# Altium schematic sheet TP4056.SchDoc: TP4056 Charging module
size A4; Revision: 1.0; SheetNumber: 2; SheetTotal: 2
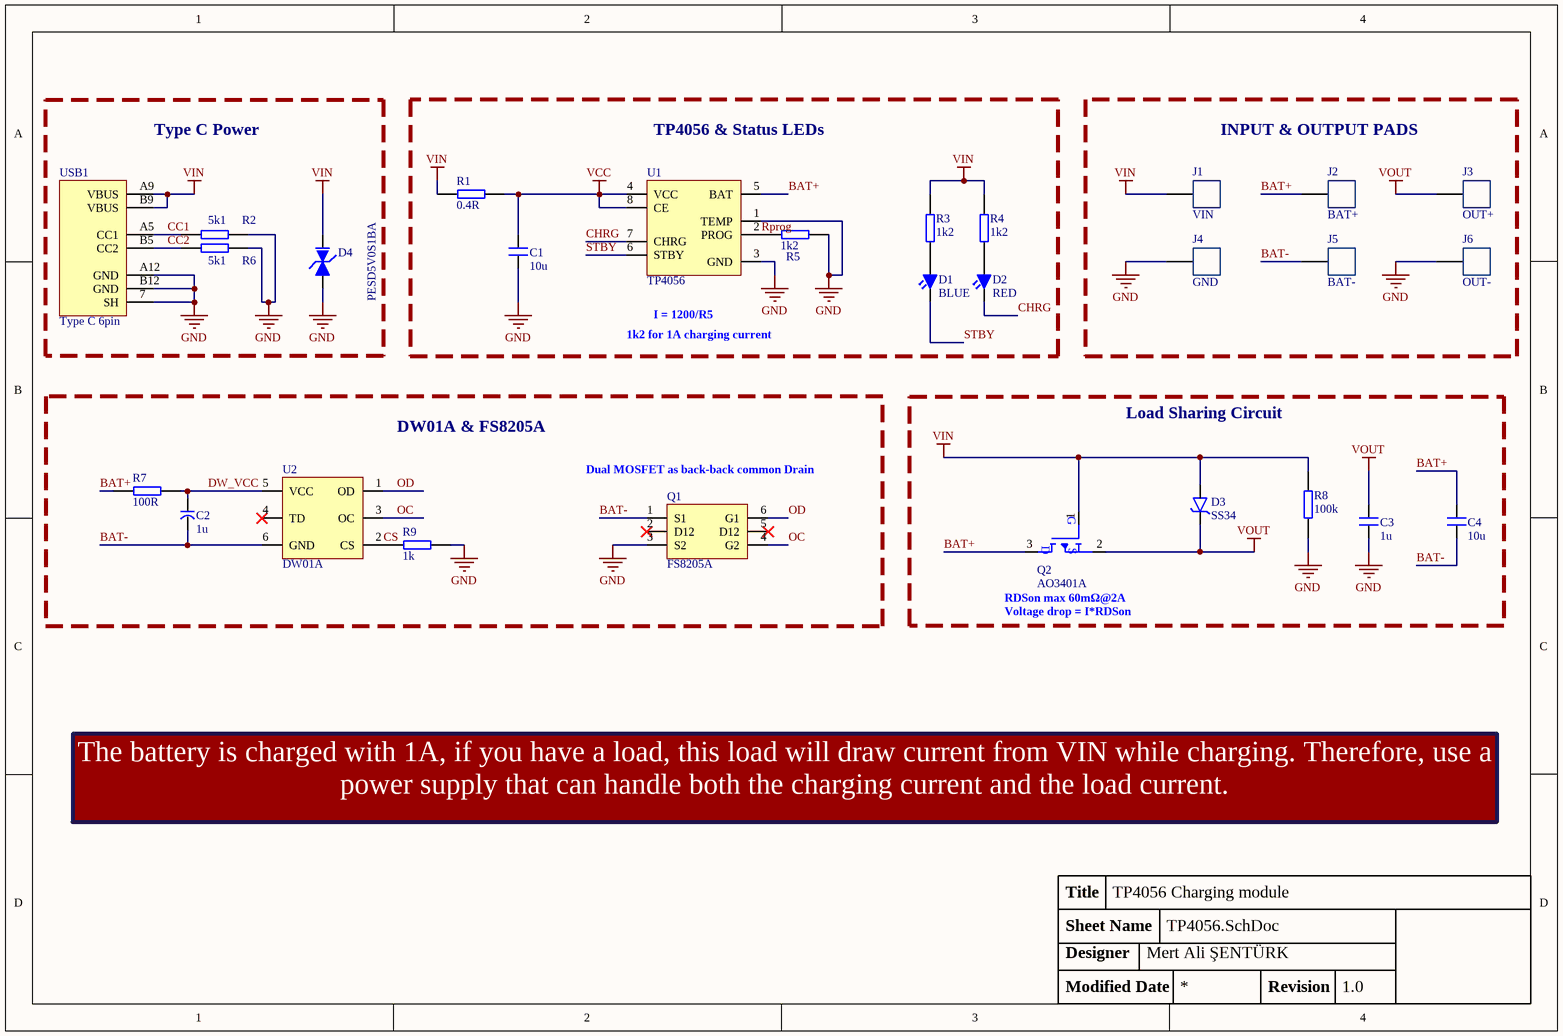
[diagram p0: TP4056.SchDoc]

## Parts
C1  10u  [0603 CAP]
C2  1u  [3216 cap]
C3  1u  [0805 CAP]
C4  10u  [0603 CAP]
D1  BLUE  [LED 0805]
D2  RED  [LED 0805]
D3  SS34  [SMA/DO-214AC]
D4  PESD5V0S1BA  [SOD-323]
J1  VIN  [PAD]  (no BOM)
J2  BAT+  [PAD]  (no BOM)
J3  OUT+  [PAD]  (no BOM)
J4  GND  [PAD]  (no BOM)
J5  BAT-  [PAD]  (no BOM)
J6  OUT-  [PAD]  (no BOM)
Q1  FS8205A  [SOT23-6]
Q2  AO3401A  [SOT23]
R1  0.4R  [2512 RES]
R2  5k1  [0603 RES]
R3  1k2  [0603 RES]
R4  1k2  [0603 RES]
R5  1k2  [0603 RES]
R6  5k1  [0603 RES]
R7  100R  [0603 RES]
R8  100k  [0603 RES]
R9  1k  [0603 RES]
U1  TP4056  [SOP-8]
U2  DW01A  [SOT23-6]
USB1  Type C 6pin  [TYPE-C 6P(073)]

## Blocks framed on the sheet
Type C Power: D4 R2 R6 USB1
TP4056 & Status LEDs: C1 D1 D2 R1 R3-R5 U1
INPUT & OUTPUT PADS: J1-J6
DW01A & FS8205A: C2 Q1 R7 R9 U2
Load Sharing Circuit: C3 C4 D3 Q2 R8

## Nets
GND: C1.1 C3.1 D4.2 J4.1 J6.1 Q1.3(S2) R2.2 R5.2 R6.2 R8.1 R9.2 U1.1(TEMP) U1.3(GND) USB1.7(SH) USB1.A12(GND) USB1.B12(GND)
VCC: C1.2 R1.1 U1.4(VCC) U1.8(CE)
VIN: D3.2 D4.1 J1.1 Q2.1 R1.2 R3.2 R4.2 R8.2 USB1.A9(VBUS) USB1.B9(VBUS)
VOUT: C3.2 D3.1 J3.1 Q2.2
BAT+: C4.2 J2.1 Q2.3 R7.1 U1.5(BAT)
BAT-: C2.2 C4.1 J5.1 Q1.1(S1) U2.6(GND)
CC1: R2.1 USB1.A5(CC1)
CC2: R6.1 USB1.B5(CC2)
CHRG: D2.1 U1.7(CHRG)
CS: R9.1 U2.2(CS)
DW_VCC: C2.1 R7.2 U2.5(VCC)
OC: Q1.4(G2) U2.3(OC)
OD: Q1.6(G1) U2.1(OD)
Rprog: R5.1 U1.2(PROG)
STBY: D1.1 U1.6(STBY)
NetD1_2: D1.2 R3.1
NetD2_2: D2.2 R4.1

Not connected (* = marked no-connect by the designer): Q1 2(D12)* 5(D12)*; U2 4(TD)*

## Notes on the sheet
- 1k2 for 1A charging current
- (near U1) I = 1200/R5
- (near Q1) Dual MOSFET as back-back common Drain
- Voltage drop = I*RDSon
- (near Q2) RDSon max 60mΩ@2A
- The battery is charged with 1A, if you have a load, this load will draw current from VIN while charging. Therefore, use a power supply that can handle both the charging current and the load current.
- Title
- Sheet Name
- Designer
- Mert Ali ŞENTÜRK
- Modified Date
- Revision
- (in symbol AO3401A) G; D; S

## Library data of the parts
C1 C4 = 0603 100p CAP: CL10A106MA8NRNC; Case: 0603
C2 = 3216 Tantal Cap SMD
C3 = 0805 10u CAP: Case: 0805
D1 = LED GREEN 0805
D2 = LED RED 0805
D3 = SS34: 40V Independent Type 3A 550mV@3A SMA(DO-214AC) Schottky Diodes ROHS
D4 = PESD5V0S1BA: 11A 8V 5.6V Bidirectional 5V SOD-323  ESD and Surge Protection (TVS/ESD) ROHS
J1-J6 = PAD: Solder pad
Q1 = FS8205A: 20V 6A 18mΩ@4.5V,6A 1.5W 1.2V@250uA 2 N-Channel SOT-23-6L MOSFETs ROHS
Q2 = AO3401A: 30V 4A 44mΩ@10V,4.3A 1.4W 1.3V@250uA 1 Piece P-Channel SOT-23 MOSFETs ROHS
R1 = 2512 RES: 25121WJ040KT4E
R2 R6 = 0603 0R RES: Case: 0603
R3-R5 = 0603 1k RES: 0603WAF1201T5E; Case: 0603
R7 R9 = 0603 1k RES: Case: 0603
R8 = 0603 100R RES: Case: 0603
U1 = TP4056: 1A Standalone Linear Li-lon Battery Charger with Thermal Regulation
U2 = DW01A: BATTERY PROTECTION IC IN A SOT23
USB1 = USB TYPE-C 6P(073) (Right Angle): Manufacturer SHOU HAN / MFR.Part # TYPE-C 6P(073) / JLCPCB Part # C668623; Current Rating: 5A; Voltage Rating: 5V; Manufacturer: SHOU HAN; JLCPCB Part: C668623